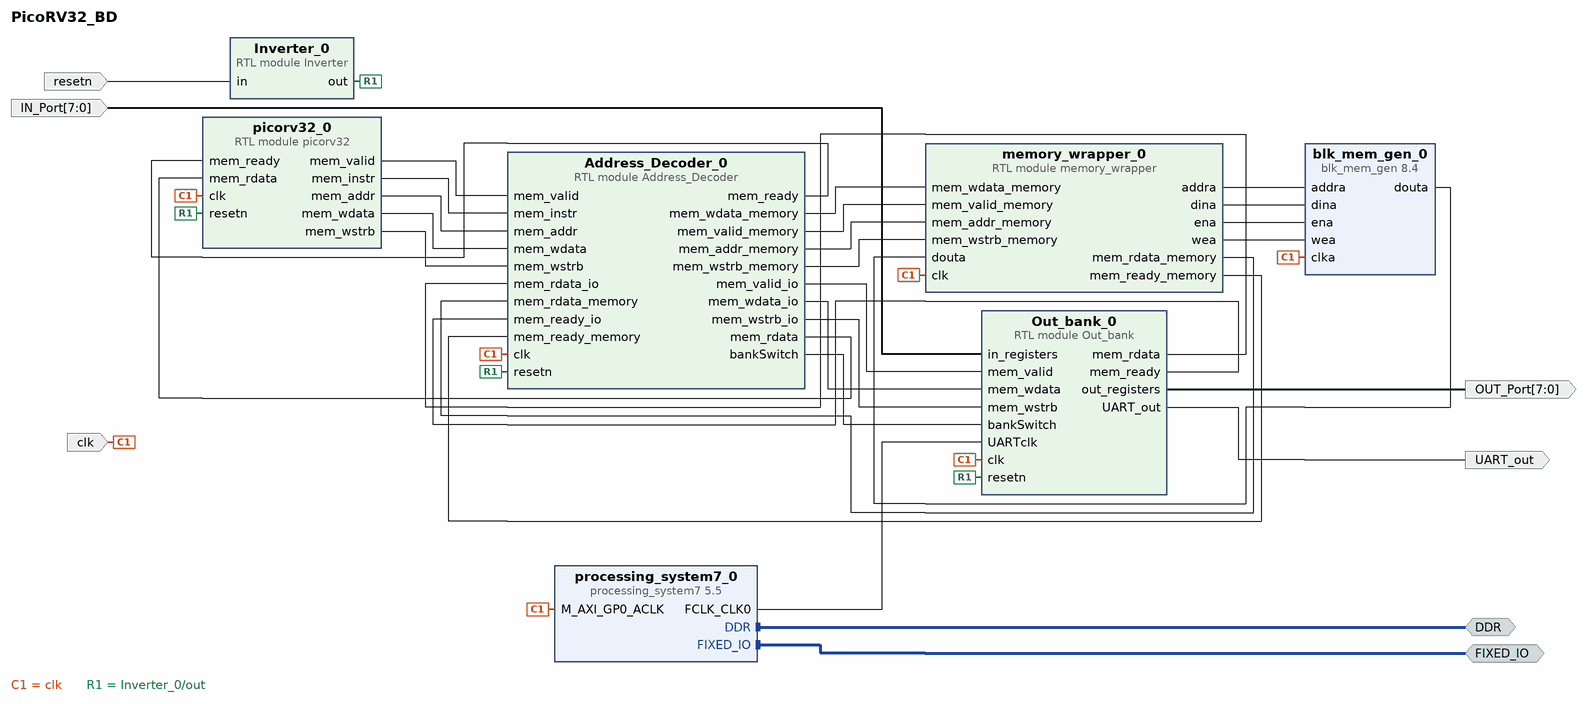
[diagram p0: block diagram of the top level]
# Vivado block design PicoRV32_BD, xc7z020clg484-1, Vivado 2017.4
create_bd_design PicoRV32_BD

create_bd_intf_port -mode Master -vlnv xilinx.com:interface:ddrx_rtl:1.0 DDR
create_bd_intf_port -mode Master -vlnv xilinx.com:display_processing_system7:fixedio_rtl:1.0 FIXED_IO
create_bd_port -dir O -type data UART_out
create_bd_port -dir O -from 7 -to 0 -type data OUT_Port
create_bd_port -dir I -type clk clk
create_bd_port -dir I -type rst resetn
set_property -dict {CONFIG.POLARITY ACTIVE_LOW} [get_bd_ports resetn]
create_bd_port -dir I -from 7 -to 0 IN_Port

create_bd_cell -type ip -vlnv xilinx.com:ip:processing_system7:5.5 processing_system7_0
set_property -dict [list \
  CONFIG.PCW_UIPARAM_DDR_FREQ_MHZ 533.333313 \
  CONFIG.PCW_APU_PERIPHERAL_FREQMHZ 666.666667 \
  CONFIG.PCW_SDIO_PERIPHERAL_FREQMHZ 50 \
  CONFIG.PCW_UART_PERIPHERAL_FREQMHZ 50 \
  CONFIG.PCW_FPGA0_PERIPHERAL_FREQMHZ 0.25 \
  CONFIG.PCW_FPGA1_PERIPHERAL_FREQMHZ 150.000000 \
  CONFIG.PCW_PRESET_BANK1_VOLTAGE {LVCMOS 1.8V} \
  CONFIG.PCW_UIPARAM_DDR_PARTNO {MT41J128M16 HA-15E} \
  CONFIG.PCW_QSPI_PERIPHERAL_ENABLE 1 \
  CONFIG.PCW_QSPI_QSPI_IO {MIO 1 .. 6} \
  CONFIG.PCW_QSPI_GRP_SINGLE_SS_ENABLE 1 \
  CONFIG.PCW_QSPI_GRP_SINGLE_SS_IO {MIO 1 .. 6} \
  CONFIG.PCW_SINGLE_QSPI_DATA_MODE x4 \
  CONFIG.PCW_ENET0_PERIPHERAL_ENABLE 1 \
  CONFIG.PCW_ENET0_ENET0_IO {MIO 16 .. 27} \
  CONFIG.PCW_ENET0_GRP_MDIO_ENABLE 1 \
  CONFIG.PCW_ENET0_GRP_MDIO_IO {MIO 52 .. 53} \
  CONFIG.PCW_ENET_RESET_ENABLE 1 \
  CONFIG.PCW_ENET_RESET_SELECT {Share reset pin} \
  CONFIG.PCW_ENET0_RESET_ENABLE 0 \
  CONFIG.PCW_SD0_PERIPHERAL_ENABLE 1 \
  CONFIG.PCW_SD0_SD0_IO {MIO 40 .. 45} \
  CONFIG.PCW_SD0_GRP_CD_ENABLE 1 \
  CONFIG.PCW_SD0_GRP_CD_IO {MIO 47} \
  CONFIG.PCW_SD0_GRP_WP_ENABLE 1 \
  CONFIG.PCW_SD0_GRP_WP_IO {MIO 46} \
  CONFIG.PCW_UART1_PERIPHERAL_ENABLE 1 \
  CONFIG.PCW_UART1_UART1_IO {MIO 48 .. 49} \
  CONFIG.PCW_TTC0_PERIPHERAL_ENABLE 1 \
  CONFIG.PCW_TTC0_TTC0_IO EMIO \
  CONFIG.PCW_USB0_PERIPHERAL_ENABLE 1 \
  CONFIG.PCW_USB0_USB0_IO {MIO 28 .. 39} \
  CONFIG.PCW_USB_RESET_ENABLE 1 \
  CONFIG.PCW_USB_RESET_SELECT {Share reset pin} \
  CONFIG.PCW_USB0_RESET_ENABLE 0 \
  CONFIG.PCW_I2C_RESET_ENABLE 1 \
  CONFIG.PCW_GPIO_MIO_GPIO_ENABLE 1 \
  CONFIG.PCW_GPIO_MIO_GPIO_IO MIO \
  CONFIG.preset ZedBoard \
] [get_bd_cells processing_system7_0]
# 223 more settings of processing_system7_0 are not shown: defaults, MIO pin electricals, DDR timing, and values the tool derives
create_bd_cell -type ip -vlnv xilinx.com:ip:blk_mem_gen:8.4 blk_mem_gen_0
set_property -dict [list \
  CONFIG.Enable_32bit_Address true \
  CONFIG.Write_Width_A 32 \
  CONFIG.Write_Depth_A 65536 \
  CONFIG.Read_Width_A 32 \
  CONFIG.Enable_A Use_ENA_Pin \
  CONFIG.Register_PortA_Output_of_Memory_Primitives true \
  CONFIG.Register_PortA_Output_of_Memory_Core false \
  CONFIG.Load_Init_File true \
  CONFIG.Coe_File ../../../../imports/SharedFolder/out.coe \
  CONFIG.Fill_Remaining_Memory_Locations false \
  CONFIG.Use_RSTA_Pin true \
  CONFIG.use_bram_block Stand_Alone \
  CONFIG.EN_SAFETY_CKT true \
] [get_bd_cells blk_mem_gen_0]
create_bd_cell -type module -reference memory_wrapper memory_wrapper_0
create_bd_cell -type module -reference Inverter Inverter_0
create_bd_cell -type module -reference Out_bank Out_bank_0
create_bd_cell -type module -reference Address_Decoder Address_Decoder_0
set_property -dict [list \
  CONFIG.MEMORY_STARTADDRESS 0x00000000 \
  CONFIG.MEMORY_ENDADDRESS 0x00040FFF \
  CONFIG.IO_STARTADDRESS 0x00041000 \
  CONFIG.IO_ENDADDRESS 0x00041004 \
] [get_bd_cells Address_Decoder_0]
create_bd_cell -type module -reference picorv32 picorv32_0
set_property -dict [list \
  CONFIG.LATCHED_MEM_RDATA 0 \
  CONFIG.BARREL_SHIFTER 1 \
  CONFIG.COMPRESSED_ISA 1 \
  CONFIG.CATCH_MISALIGN 1 \
  CONFIG.ENABLE_IRQ 1 \
  CONFIG.REGS_INIT_ZERO 1 \
  CONFIG.PROGADDR_RESET 0x00001000 \
  CONFIG.PROGADDR_IRQ 0x00000010 \
  CONFIG.STACKADDR 0x00040FF0 \
] [get_bd_cells picorv32_0]

# ---- connections ----

connect_bd_intf_net [get_bd_intf_ports DDR] [get_bd_intf_pins processing_system7_0/DDR]
connect_bd_intf_net [get_bd_intf_ports FIXED_IO] [get_bd_intf_pins processing_system7_0/FIXED_IO]
connect_bd_net [get_bd_pins picorv32_0/mem_valid] [get_bd_pins Address_Decoder_0/mem_valid]
connect_bd_net [get_bd_pins picorv32_0/mem_instr] [get_bd_pins Address_Decoder_0/mem_instr]
connect_bd_net [get_bd_pins picorv32_0/mem_addr] [get_bd_pins Address_Decoder_0/mem_addr]
connect_bd_net [get_bd_pins picorv32_0/mem_wdata] [get_bd_pins Address_Decoder_0/mem_wdata]
connect_bd_net [get_bd_pins picorv32_0/mem_wstrb] [get_bd_pins Address_Decoder_0/mem_wstrb]
connect_bd_net [get_bd_pins Address_Decoder_0/mem_ready] [get_bd_pins picorv32_0/mem_ready]
connect_bd_net [get_bd_pins Address_Decoder_0/mem_valid_io] [get_bd_pins Out_bank_0/mem_valid]
connect_bd_net [get_bd_pins Address_Decoder_0/mem_wdata_io] [get_bd_pins Out_bank_0/mem_wdata]
connect_bd_net [get_bd_pins Address_Decoder_0/mem_wstrb_io] [get_bd_pins Out_bank_0/mem_wstrb]
connect_bd_net [get_bd_pins Address_Decoder_0/bankSwitch] [get_bd_pins Out_bank_0/bankSwitch]
connect_bd_net [get_bd_pins Out_bank_0/mem_rdata] [get_bd_pins Address_Decoder_0/mem_rdata_io]
connect_bd_net [get_bd_pins Out_bank_0/mem_ready] [get_bd_pins Address_Decoder_0/mem_ready_io]
connect_bd_net [get_bd_pins Out_bank_0/UART_out] [get_bd_ports UART_out]
connect_bd_net [get_bd_pins Out_bank_0/out_registers] [get_bd_ports OUT_Port]
connect_bd_net [get_bd_ports clk] \
  [get_bd_pins processing_system7_0/M_AXI_GP0_ACLK] [get_bd_pins memory_wrapper_0/clk] [get_bd_pins blk_mem_gen_0/clka] \
  [get_bd_pins Out_bank_0/clk] [get_bd_pins Address_Decoder_0/clk] [get_bd_pins picorv32_0/clk]
connect_bd_net [get_bd_pins Address_Decoder_0/mem_rdata] [get_bd_pins picorv32_0/mem_rdata]
connect_bd_net [get_bd_pins memory_wrapper_0/addra] [get_bd_pins blk_mem_gen_0/addra]
connect_bd_net [get_bd_pins memory_wrapper_0/dina] [get_bd_pins blk_mem_gen_0/dina]
connect_bd_net [get_bd_pins memory_wrapper_0/ena] [get_bd_pins blk_mem_gen_0/ena]
connect_bd_net [get_bd_pins memory_wrapper_0/wea] [get_bd_pins blk_mem_gen_0/wea]
connect_bd_net [get_bd_pins blk_mem_gen_0/douta] [get_bd_pins memory_wrapper_0/douta]
connect_bd_net [get_bd_pins Address_Decoder_0/mem_wdata_memory] [get_bd_pins memory_wrapper_0/mem_wdata_memory]
connect_bd_net [get_bd_pins Address_Decoder_0/mem_valid_memory] [get_bd_pins memory_wrapper_0/mem_valid_memory]
connect_bd_net [get_bd_pins Address_Decoder_0/mem_addr_memory] [get_bd_pins memory_wrapper_0/mem_addr_memory]
connect_bd_net [get_bd_pins Address_Decoder_0/mem_wstrb_memory] [get_bd_pins memory_wrapper_0/mem_wstrb_memory]
connect_bd_net [get_bd_pins memory_wrapper_0/mem_rdata_memory] [get_bd_pins Address_Decoder_0/mem_rdata_memory]
connect_bd_net [get_bd_pins memory_wrapper_0/mem_ready_memory] [get_bd_pins Address_Decoder_0/mem_ready_memory]
connect_bd_net [get_bd_ports resetn] [get_bd_pins Inverter_0/in]
connect_bd_net [get_bd_pins Inverter_0/out] [get_bd_pins Out_bank_0/resetn] [get_bd_pins Address_Decoder_0/resetn] [get_bd_pins picorv32_0/resetn]
connect_bd_net [get_bd_pins processing_system7_0/FCLK_CLK0] [get_bd_pins Out_bank_0/UARTclk]
connect_bd_net [get_bd_ports IN_Port] [get_bd_pins Out_bank_0/in_registers]

validate_bd_design
save_bd_design
